# EAGLE design DisplayAdapter_rev2 (EAGLE 6.5.0)
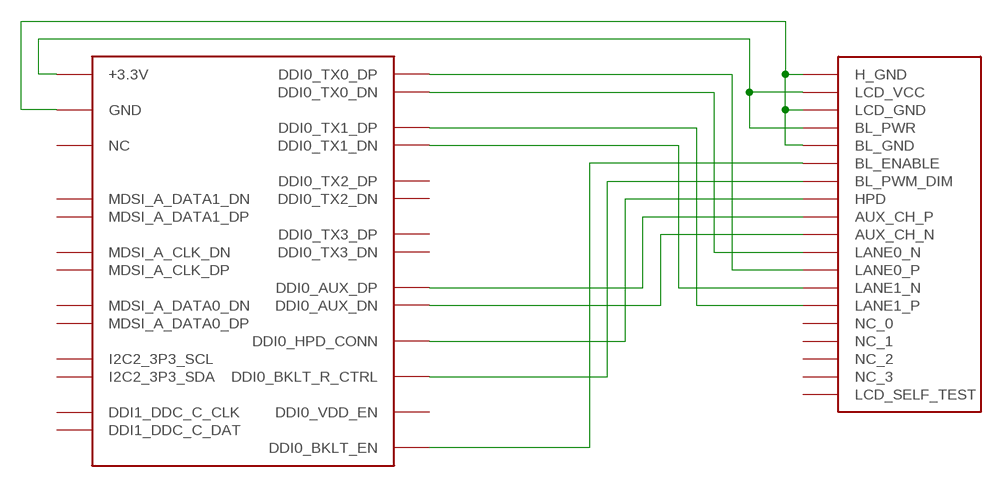
[diagram p0: schematic, sheet 1]

## Parts
FH35C  FH35C-41S-0.3SHW(50)_BAREBONE  [FH35C-41S-0.3SHW(50)_BAREBONE]
U$2  STE-I-PEX-20455-030E-12  [STE-I-PEX-20455-030E-12]

## Nets
AUX_CH_N: FH35C.PIN29(DDI0_AUX_DN) U$2.PIN10(AUX_CH_N)
AUX_CH_P: FH35C.PIN28(DDI0_AUX_DP) U$2.PIN9(AUX_CH_P)
LANE0_N: FH35C.PIN17(DDI0_TX0_DN) U$2.PIN6(LANE0_N)
LANE0_P: FH35C.PIN16(DDI0_TX0_DP) U$2.PIN7(LANE0_P)
LANE1_N: FH35C.PIN20(DDI0_TX1_DN) U$2.PIN3(LANE1_N)
LANE1_P: FH35C.PIN19(DDI0_TX1_DP) U$2.PIN4(LANE1_P)
N$7: FH35C.PIN31(DDI0_HPD_CONN) U$2.PIN17(HPD)
N$8: FH35C.PIN32(DDI0_BKLT_R_CTRL) U$2.PIN23(BL_PWM_DIM)
N$9: FH35C.PIN37(+3.3V) FH35C.PIN38(+3.3V) FH35C.PIN39(+3.3V) FH35C.PIN40(+3.3V) FH35C.PIN41(+3.3V) U$2.PIN12(LCD_VCC) U$2.PIN13(LCD_VCC) U$2.PIN26(BL_PWR) U$2.PIN27(BL_PWR) U$2.PIN28(BL_PWR) U$2.PIN29(BL_PWR)
N$10: FH35C.PIN3(GND) FH35C.PIN6(GND) FH35C.PIN9(GND) FH35C.PIN12(GND) FH35C.PIN15(GND) FH35C.PIN18(GND) FH35C.PIN21(GND) FH35C.PIN24(GND) FH35C.PIN27(GND) FH35C.PIN30(GND) FH35C.PIN42(GND) FH35C.PIN43(GND) U$2.PIN2(H_GND) U$2.PIN5(H_GND) U$2.PIN8(H_GND) U$2.PIN11(H_GND) U$2.PIN15(LCD_GND) U$2.PIN16(LCD_GND) U$2.PIN18(BL_GND) U$2.PIN19(BL_GND) U$2.PIN20(BL_GND) U$2.PIN21(BL_GND)
N$11: FH35C.PIN34(DDI0_BKLT_EN) U$2.PIN22(BL_ENABLE)
Unconnected: FH35C.PIN1(MDSI_A_DATA1_DN) FH35C.PIN2(MDSI_A_DATA1_DP) FH35C.PIN4(MDSI_A_CLK_DN) FH35C.PIN5(MDSI_A_CLK_DP) FH35C.PIN7(MDSI_A_DATA0_DN) FH35C.PIN8(MDSI_A_DATA0_DP) FH35C.PIN10(I2C2_3P3_SCL) FH35C.PIN11(I2C2_3P3_SDA) FH35C.PIN13(DDI1_DDC_C_CLK) FH35C.PIN14(DDI1_DDC_C_DAT) FH35C.PIN22(DDI0_TX2_DP) FH35C.PIN23(DDI0_TX2_DN) FH35C.PIN25(DDI0_TX3_DP) FH35C.PIN26(DDI0_TX3_DN) FH35C.PIN33(DDI0_VDD_EN) FH35C.PIN35(NC) FH35C.PIN36(NC) U$2.PIN1(NC_0) U$2.PIN14(LCD_SELF_TEST) U$2.PIN24(NC_1) U$2.PIN25(NC_2) U$2.PIN30(NC_3)

## Library data of the parts
FH35C = FH35C_connector:FH35C-41S-0.3SHW(50)_BAREBONE
U$2 = STE-I-PEX-20455-030E-12:STE-I-PEX-20455-030E-12

## Board
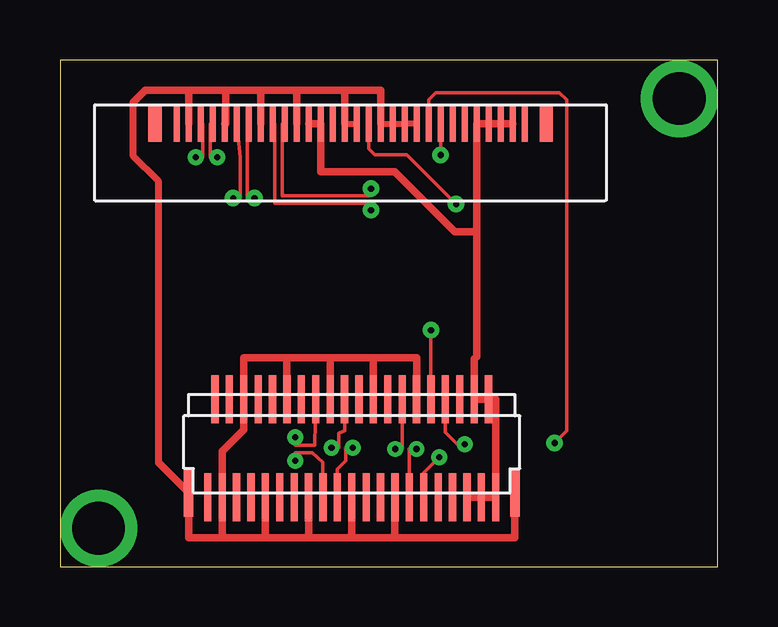
[diagram p1: board, top side]
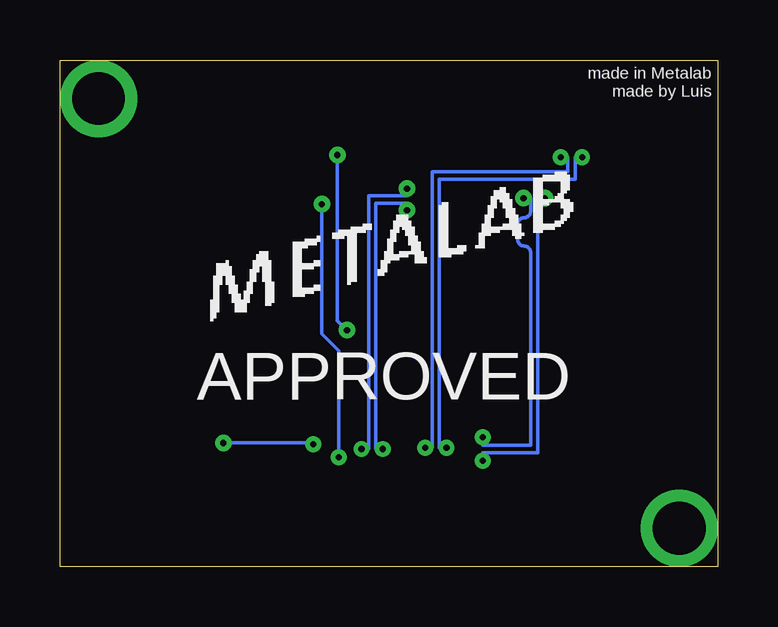
[diagram p2: board, bottom side, seen from below]

Size 27.4 x 21.1 mm. Coordinates in mm from the lower left corner, seen from the top.
Outline: 0,0 27.4,0 27.4,21.1 0,21.1 0,0
Copper layers (1*16): Top 0.035mm / dielectric 1.5mm / Bottom 0.035mm
Design rules "default *": minimum track width 6mil, minimum drill 10mil, track to track 6mil, track to pad 6mil, pad to pad 6mil, via to via 6mil, smd to smd 6mil, copper to edge 40mil, drill to drill 8mil, minimum pad ring 10mil, minimum via ring 8mil, stop-mask expansion 4mil, vias tented up to drill 10mil, thermal gap 10mil

### Footprints (pad centres in the part's own frame; a part is rotated, then mirrored left to right if it is on the bottom)
FH35C-41S-0.3SHW(50)_BAREBONE = smd 0.3 x 2: PIN1 -6,-1.6; PIN2 -5.7,2.5; PIN3 -5.4,-1.6; PIN4 -5.1,2.5; PIN5 -4.8,-1.6; PIN6 -4.5,2.5; PIN7 -4.2,-1.6; PIN8 -3.9,2.5; PIN9 -3.6,-1.6; PIN10 -3.3,2.5; PIN11 -3,-1.6; PIN12 -2.7,2.5; PIN13 -2.4,-1.6; PIN14 -2.1,2.5; PIN15 -1.8,-1.6; PIN16 -1.5,2.5; PIN17 -1.2,-1.6; PIN18 -0.9,2.5; PIN19 -0.6,-1.6; PIN20 -0.3,2.5; PIN21 0,-1.6; PIN22 0.3,2.5; PIN23 0.6,-1.6; PIN24 0.9,2.5; PIN25 1.2,-1.6; PIN26 1.5,2.5; PIN27 1.8,-1.6; PIN28 2.1,2.5; PIN29 2.4,-1.6; PIN30 2.7,2.5; PIN31 3,-1.6; PIN32 3.3,2.5; PIN33 3.6,-1.6; PIN34 3.9,2.5; PIN35 4.2,-1.6; PIN36 4.5,2.5; PIN37 4.8,-1.6; PIN38 5.1,2.5; PIN39 5.4,-1.6; PIN40 5.7,2.5; PIN41 6,-1.6 | smd 0.4 x 2: PIN42 -6.8,-1.4; PIN43 6.8,-1.4
STE-I-PEX-20455-030E-12 = smd 0.55 x 1.5: P$30 -8.2,1.2; P$31 8.1,1.2 | smd 0.25 x 1.5: PIN1 -7.3,1.2; PIN2 -6.8,1.2; PIN3 -6.3,1.2; PIN4 -5.8,1.2; PIN5 -5.3,1.2; PIN6 -4.8,1.2; PIN7 -4.3,1.2; PIN8 -3.8,1.2; PIN9 -3.3,1.2; PIN10 -2.8,1.2; PIN11 -2.3,1.2; PIN12 -1.8,1.2; PIN13 -1.3,1.2; PIN14 -0.8,1.2; PIN15 -0.3,1.2; PIN16 0.2,1.2; PIN17 0.7,1.2; PIN18 1.2,1.2; PIN19 1.7,1.2; PIN20 2.2,1.2; PIN21 2.7,1.2; PIN22 3.2,1.2; PIN23 3.7,1.2; PIN24 4.2,1.2; PIN25 4.7,1.2; PIN26 5.2,1.2; PIN27 5.7,1.2; PIN28 6.2,1.2; PIN29 6.7,1.2; PIN30 7.2,1.2

### Placement (x,y rotation side)
FH35C  12.15,4.48 0 top
U$2  12.15,17.25 0 top

### Tracks (layer width: path | path; a pad name or v marks a point on that pad's centre or on a via)
AUX_CH_N  (via drill 0.25, 0.25 pad 0.69)
  Top 0.152: U$2.PIN10 9.25,18.45 9.25,15.45 12.95,15.45 v12.95,15.74 | v14.85,4.9 14.55,4.9 14.55,4.4 FH35C.PIN29
  Bottom 0.152: v12.95,15.74 12.95,15.45 14.55,15.45 14.55,4.9 v14.85,4.9
AUX_CH_P  (via drill 0.25, 0.25 pad 0.69)
  Top 0.152: U$2.PIN9 8.95,18.45 8.95,15.15 12.95,15.15 v12.95,14.86 | v13.96,4.9 14.25,4.9 14.25,4.95 14.25,5.75 FH35C.PIN28
  Bottom 0.152: v12.95,14.86 12.95,15.15 14.25,15.15 14.25,4.9 v13.96,4.9
LANE0_N  (via drill 0.25, 0.25 pad 0.69)
  Top 0.152: U$2.PIN6 7.5,17.05 7.5,15.35 v7.21,15.35 | v9.8,4.41 9.8,4.75 10.5,4.75 10.95,4.35 FH35C.PIN17
  Bottom 0.152: v7.21,15.35 7.5,15.35 7.5,4.75 9.8,4.75 v9.8,4.41
LANE0_P  (via drill 0.25, 0.25 pad 0.69)
  Top 0.152: U$2.PIN7 7.8,18.45 7.8,15.35 v8.1,15.35 | v9.8,5.39 9.8,5.05 10.6,5.05 FH35C.PIN16
  Bottom 0.152: v8.1,15.35 7.8,15.35 7.8,14.8 arc90 8.07,14.53 arc-90 8.34,14.27 8.34,13.62 arc-90 8.07,13.36 arc90 7.8,13.09 7.8,5.05 9.8,5.05 v9.8,5.39
LANE1_N  (via drill 0.25)
  Top 0.152: U$2.PIN3 5.95,18.45 5.95,17.05 v5.66,17.05 | v11.31,4.95 11.6,4.95 11.6,5.55 11.85,5.65 FH35C.PIN20
  Bottom 0.152: v5.66,17.05 5.95,17.05 5.95,16.15 11.6,16.15 11.6,4.95 v11.31,4.95
LANE1_P  (via drill 0.25)
  Top 0.152: U$2.PIN4 6.25,18.45 6.25,17.05 v6.54,17.05 | v12.19,4.95 11.9,4.95 11.9,4.4 11.55,4.05 FH35C.PIN19
  Bottom 0.152: v6.54,17.05 6.25,17.05 6.25,16.45 11.9,16.45 11.9,4.95 v12.19,4.95
N$1  (via drill 2.2 pad 3)
  other vias: 1.6,1.6
N$2  (via drill 2.2 pad 3)
  other vias: 25.8,19.5
N$7  (via drill 0.25, 0.25 pad 0.69)
  Top 0.152: FH35C.PIN31 15.15,3.9 v15.8,4.55 | v16.5,15.1 14.45,17.15 13.1,17.15 12.85,17.4 U$2.PIN17
  Bottom 0.152: v15.8,4.55 15.8,9 16.5,9.7 v16.5,15.1
N$8  (via drill 0.25 pad 0.69)
  Top 0.152: U$2.PIN23 v15.85,17.15 | v15.45,9.85 FH35C.PIN32
  Bottom 0.152: v15.85,17.15 15.85,10.25 v15.45,9.85
N$9
  Top 0.25: U$2.PIN28 U$2.PIN27 U$2.PIN26
  Top 0.305: FH35C.PIN37 FH35C.PIN39 FH35C.PIN41 18.15,6.98 FH35C.PIN40 FH35C.PIN38 17.25,8.65 17.35,8.75 17.35,13.95 | U$2.PIN29 U$2.PIN28 U$2.PIN26 17.35,13.95 | U$2.PIN12 U$2.PIN13 10.85,16.45 13.95,16.45 16.45,13.95 17.35,13.95
N$10
  Top 0.25: U$2.PIN21 U$2.PIN20 U$2.PIN19 U$2.PIN18 | U$2.PIN15 U$2.PIN16
  Top 0.3: 4.1,4.33 4.1,16.05 3.05,17.1 3.05,19.35
  Top 0.305: U$2.PIN2 5.35,19.85 | 5.35,19.85 6.9,19.85 | 6.9,19.85 8.35,19.85 | U$2.PIN5 6.9,18.45 6.9,19.85 | U$2.PIN8 8.35,19.85 | U$2.PIN11 9.85,19.85 | FH35C.PIN43 18.95,1.2 13.95,1.2 | 13.95,1.2 12.15,1.2 | 12.15,1.2 10.35,1.2 | 10.35,1.2 8.55,1.2 | 8.55,1.2 6.75,1.2 | 6.75,1.2 5.35,1.2 FH35C.PIN42 4.1,4.33 | 6.75,1.2 FH35C.PIN3 6.75,4.8 7.65,5.7 FH35C.PIN6 7.65,8.7 9.4,8.7 | FH35C.PIN9 8.55,1.2 | FH35C.PIN15 10.35,1.2 | FH35C.PIN21 12.15,1.2 | FH35C.PIN27 13.95,1.2 | 8.35,19.85 9.85,19.85 | 5.35,19.85 3.55,19.85 3.05,19.35 | 9.4,8.7 11.3,8.7 | 11.3,8.7 13.05,8.7 | 13.05,8.7 14.85,8.7 FH35C.PIN30 | 13.05,8.7 FH35C.PIN24 | FH35C.PIN18 11.25,8.65 11.3,8.7 | FH35C.PIN12 9.45,8.65 9.4,8.7 | 9.85,19.85 11.85,19.85 | 11.85,19.85 U$2.PIN15 | U$2.PIN18 13.35,19.85 11.85,19.85
N$11  (via drill 0.25, 0.25 pad 0.69)
  Top 0.152: U$2.PIN22 15.35,19.45 15.65,19.75 20.8,19.75 21.1,19.45 21.1,5.65 v20.6,5.15 | v16.85,5.1 16.55,5.1 16.05,5.6 FH35C.PIN34
  Bottom 0.152: v20.6,5.15 16.9,5.15 v16.85,5.1

### Text on the board
bPlace: made in Metalab / made by Luis | APPROVED